# EasyEDA Pro project AmpBoard64SMD.eprj, board PCB1
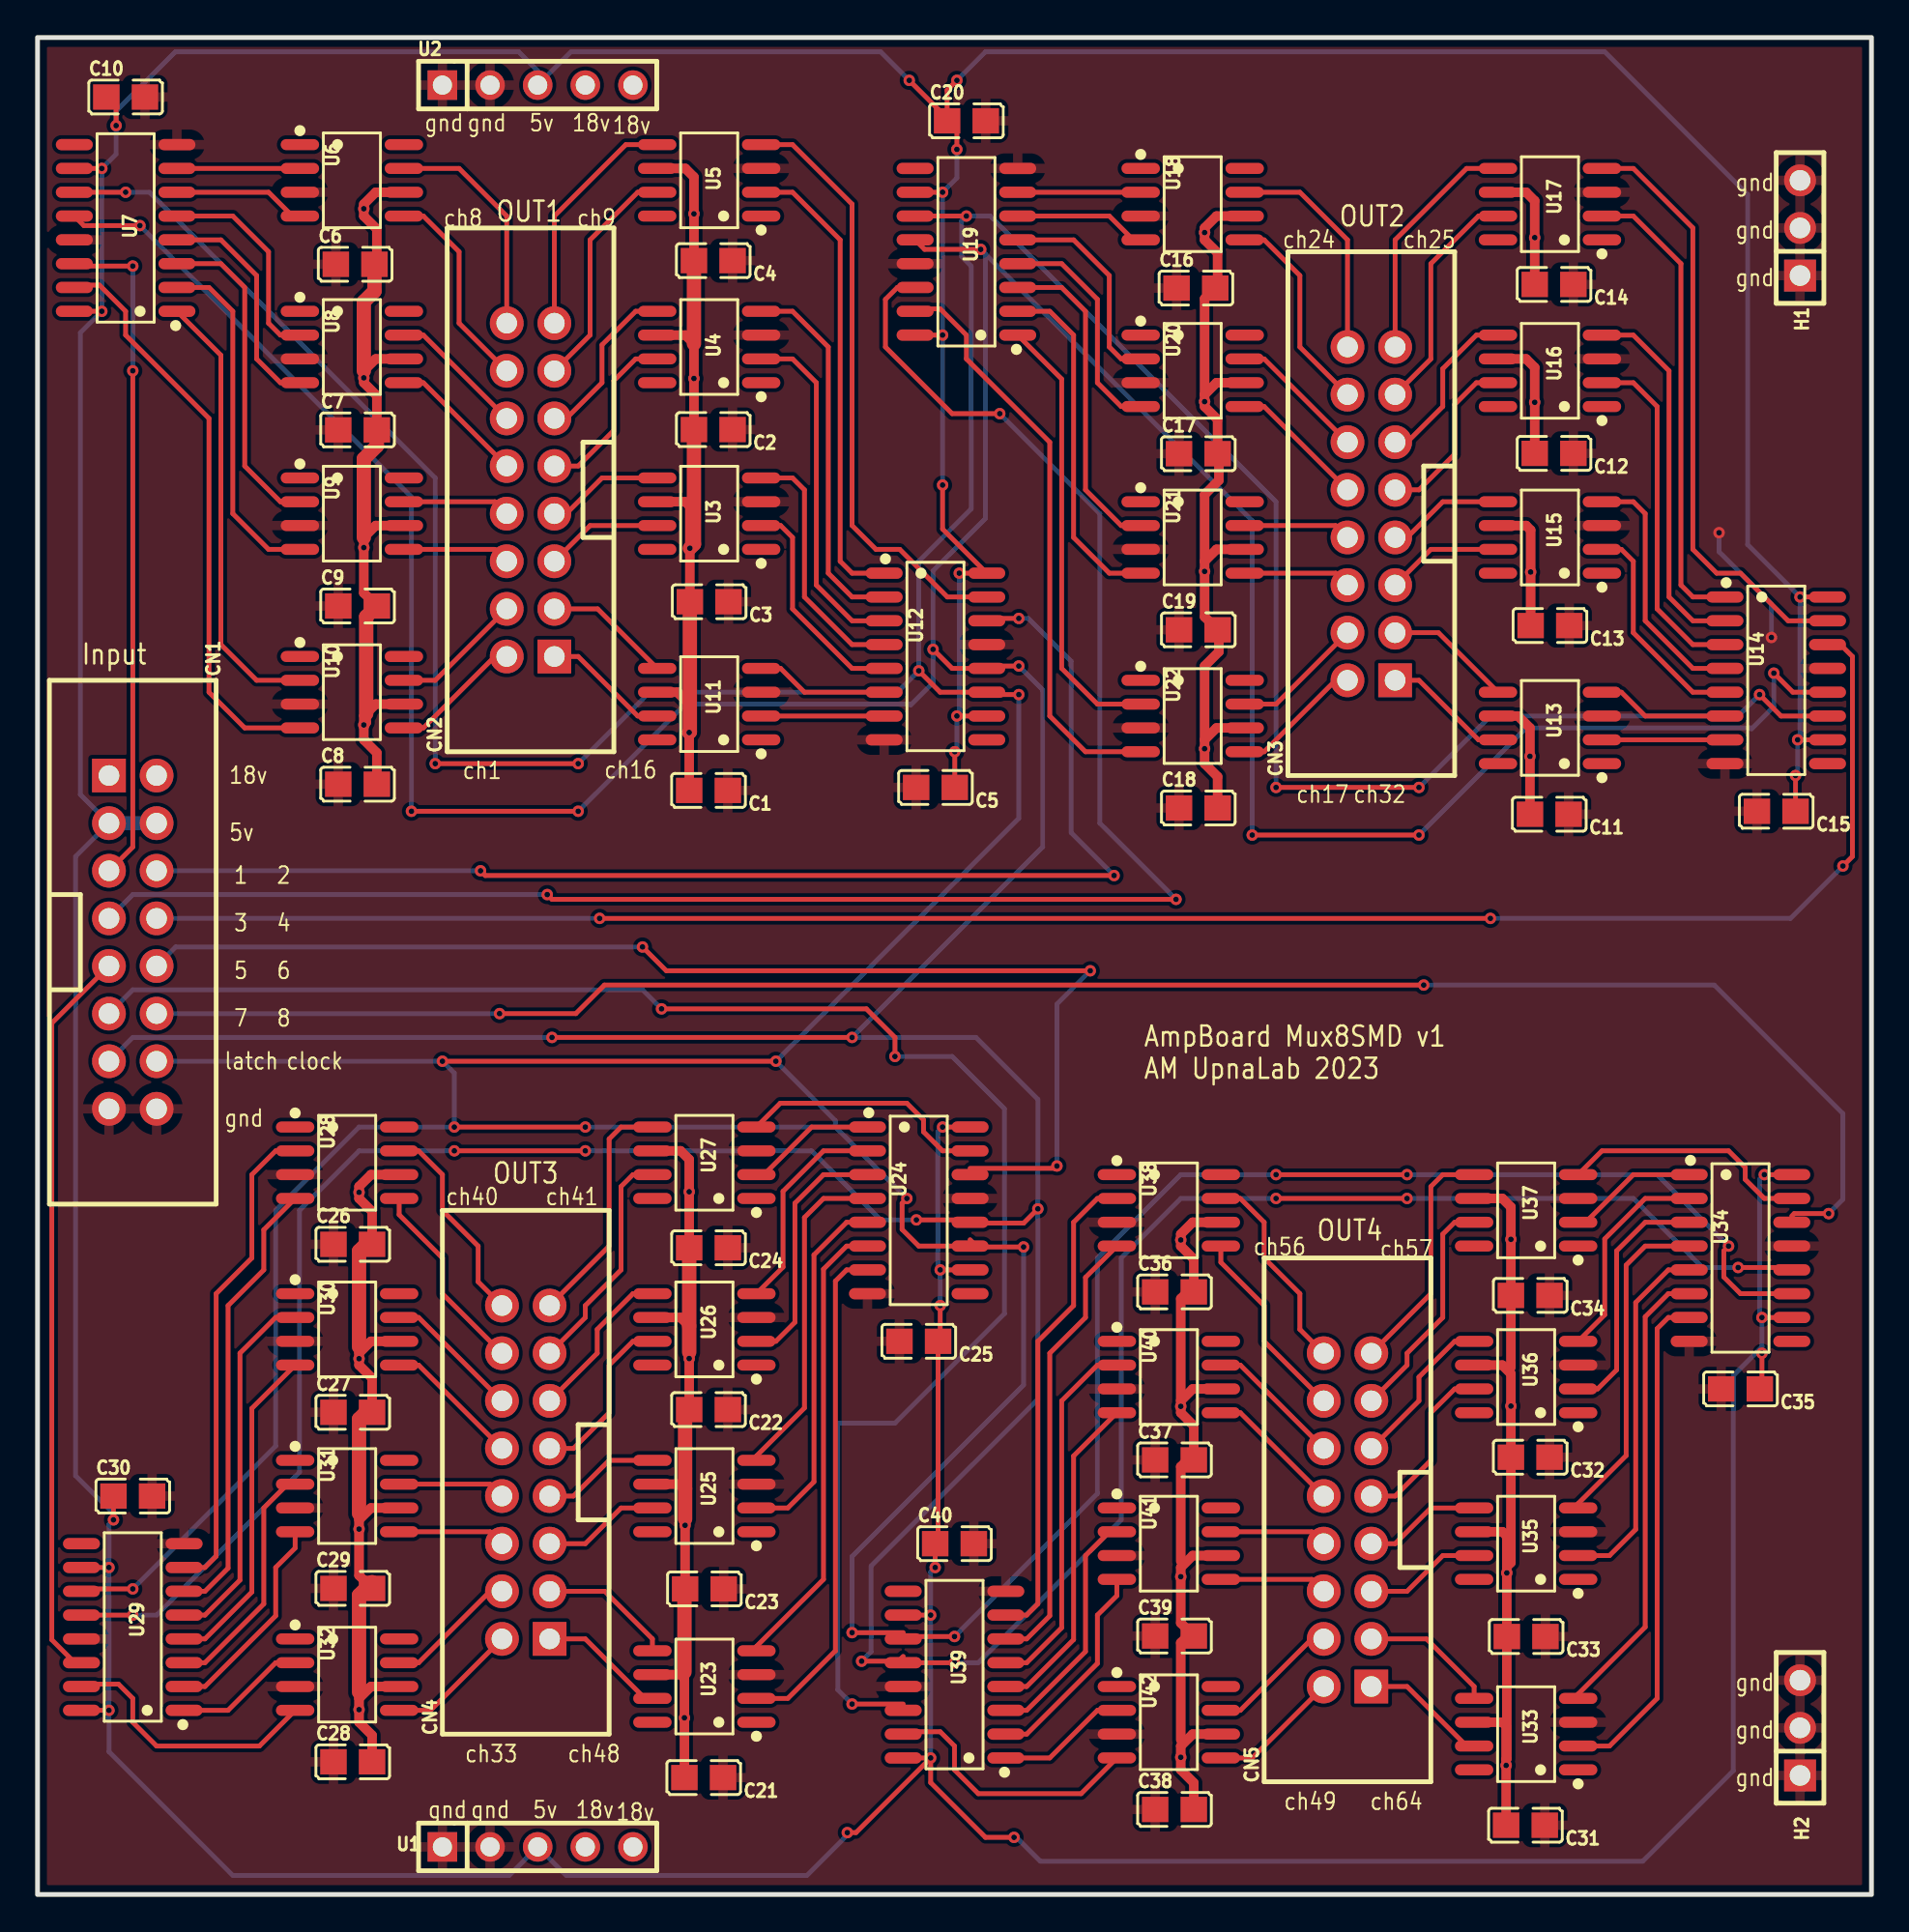
[diagram p3: board, top side]
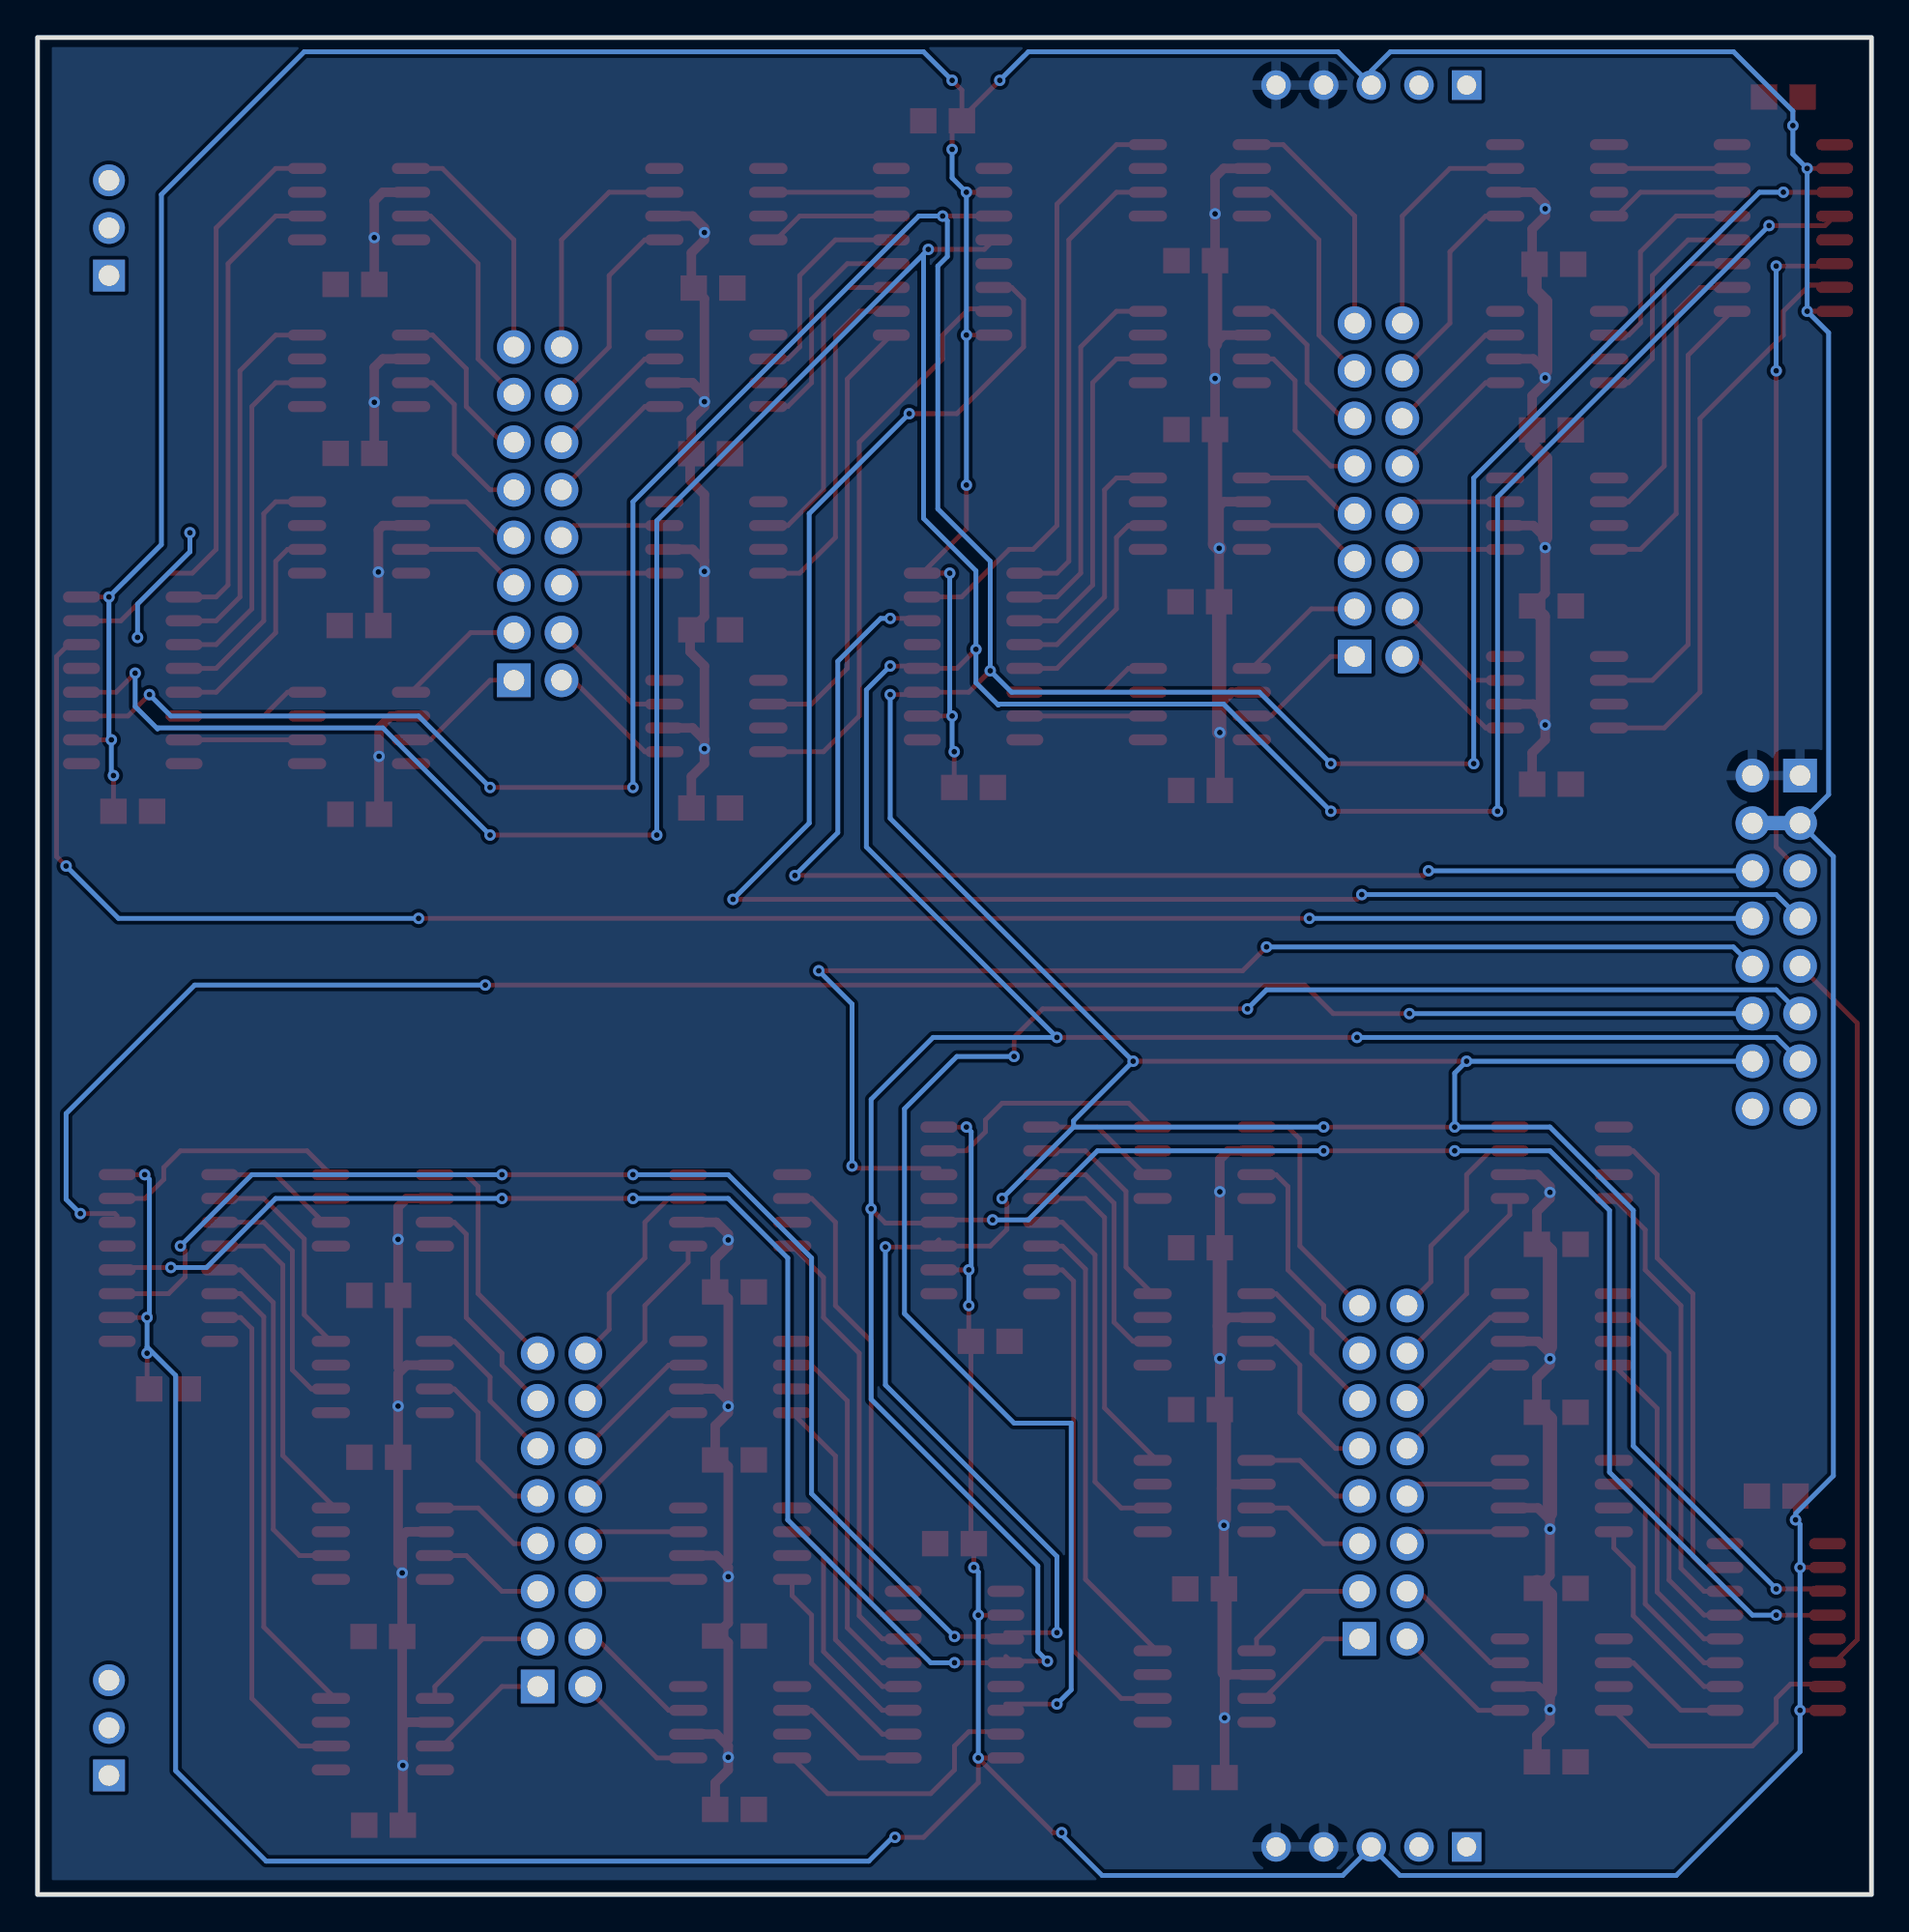
[diagram p4: board, bottom side, seen from below]

Outline 97.79 x 99.06 mm; copper layers: Top Layer, Bottom Layer. Coordinates in mm from the lower left corner of the outline.
Outline path: rectangle 0,99.06 97.79,0
Stack: Top Layer 0.035mm / Dielectric1 1.51mm FR4 er 4.5 / Bottom Layer 0.035mm

## Design rules (mm)
template: JLCPCB Capability(Two Layers Board)
spacing copperThickness1oz (default): track to track 0.102, other pairs 0.152 to 0.3
spacing copperThickness2oz: track to track 0.203, other pairs 0.152 to 0.3
track width copperThickness1oz (default): min 0.127, default 0.254, max 2.54
track width copperThickness2oz: min 0.203, default 0.254, max 2.54
differential pair differentialPair (default): width min 0.127, default 0.254, max 2.54; gap min 0.152, default 0.152
via viaSize (default): diameter min 0.5, default 0.61, max 10; hole min 0.3, default 0.305, max 6.3

## Placement (name value [footprint] x y rotation side)
C1  100pF  [C0805]  35.78 58.9 180 top
C2  100pF  [C0805]  36.03 78.14 180 top
C3  100pF  [C0805]  35.81 68.96 180 top
C4  100pF  [C0805]  36.03 87.16 180 top
C5  100pF  [C0805]  47.88 59.06 180 top
C6  100pF  [C0805]  16.94 86.96 0 top
C7  100pF  [C0805]  17.06 78.13 0 top
C8  100pF  [C0805]  17.06 59.23 0 top
C9  100pF  [C0805]  17.06 68.73 0 top
C10  100pF  [C0805]  4.7 95.89 0 top
C11  100pF  [C0805]  80.61 57.63 180 top
C12  100pF  [C0805]  80.86 76.88 180 top
C13  100pF  [C0805]  80.65 67.69 180 top
C14  100pF  [C0805]  80.86 85.89 180 top
C15  100pF  [C0805]  92.71 57.78 180 top
C16  100pF  [C0805]  61.77 85.69 0 top
C17  100pF  [C0805]  61.9 76.86 0 top
C18  100pF  [C0805]  61.9 57.96 0 top
C19  100pF  [C0805]  61.9 67.46 0 top
C20  100pF  [C0805]  49.53 94.62 0 top
C21  100pF  [C0805]  35.52 6.24 180 top
C22  100pF  [C0805]  35.78 25.87 180 top
C23  100pF  [C0805]  35.56 16.3 180 top
C24  100pF  [C0805]  35.78 34.5 180 top
C25  100pF  [C0805]  46.99 29.51 180 top
C26  100pF  [C0805]  16.81 34.68 0 top
C27  100pF  [C0805]  16.81 25.72 0 top
C28  100pF  [C0805]  16.81 7.08 0 top
C29  100pF  [C0805]  16.81 16.33 0 top
C30  100pF  [C0805]  5.08 21.25 0 top
C31  100pF  [C0805]  79.34 3.7 180 top
C32  100pF  [C0805]  79.59 23.33 180 top
C33  100pF  [C0805]  79.38 13.76 180 top
C34  100pF  [C0805]  79.59 31.96 180 top
C35  100pF  [C0805]  90.81 26.97 180 top
C36  100pF  [C0805]  60.62 32.14 0 top
C37  100pF  [C0805]  60.62 23.18 0 top
C38  100pF  [C0805]  60.62 4.54 0 top
C39  100pF  [C0805]  60.62 13.79 0 top
C40  100pF  [C0805]  48.9 18.72 0 top
CN1  KH-2.54PH180-2X8P-L8.9  [conn-th_16p-p2.54_kinghelm_kh-2.54ph180-2x8p-l8.9]  5.08 50.8 270 top
CN2  KH-2.54PH180-2X8P-L8.9  [CONN-TH_16P-P2.54_KINGHELM_KH-2.54PH180-2X8P-L8.9]  26.29 74.93 90 top
CN3  KH-2.54PH180-2X8P-L8.9  [CONN-TH_16P-P2.54_KINGHELM_KH-2.54PH180-2X8P-L8.9]  71.12 73.66 90 top
CN4  KH-2.54PH180-2X8P-L8.9  [CONN-TH_16P-P2.54_KINGHELM_KH-2.54PH180-2X8P-L8.9]  26.03 22.53 90 top
CN5  KH-2.54PH180-2X8P-L8.9  [CONN-TH_16P-P2.54_KINGHELM_KH-2.54PH180-2X8P-L8.9]  69.85 19.99 90 top
H1  KH-2.54PH180-1X3P-L11.5  [hdr-th_3p-p2.54-v-m]  93.98 88.9 90 top
H2  KH-2.54PH180-1X3P-L11.5  [hdr-th_3p-p2.54-v-m]  93.98 8.89 90 top
U1  KH-2.54FH-1X5P-H8.5  [hdr-th_5p-p2.54-v-f]  26.67 2.54 0 top
U2  KH-2.54FH-1X5P-H8.5  [hdr-th_5p-p2.54-v-f]  26.67 96.52 0 top
U3  IXDN602SIATR  [SOIC-8_L4.9-W3.9-P1.27-LS6.0-BL]  35.81 73.66 90 top
U4  IXDN602SIATR  [SOIC-8_L4.9-W3.9-P1.27-LS6.0-BL]  35.81 82.55 90 top
U5  IXDN602SIATR  [SOIC-8_L4.9-W3.9-P1.27-LS6.0-BL]  35.81 91.44 90 top
U6  IXDN602SIATR  [SOIC-8_L4.9-W3.9-P1.27-LS6.0-BL]  16.76 91.44 270 top
U7  74HC595D,118  [SOIC-16_L9.9-W3.9-P1.27-LS6.0-BL]  4.7 88.9 90 top
U8  IXDN602SIATR  [SOIC-8_L4.9-W3.9-P1.27-LS6.0-BL]  16.76 82.55 270 top
U9  IXDN602SIATR  [SOIC-8_L4.9-W3.9-P1.27-LS6.0-BL]  16.76 73.66 270 top
U10  IXDN602SIATR  [SOIC-8_L4.9-W3.9-P1.27-LS6.0-BL]  16.76 64.14 270 top
U11  IXDN602SIATR  [SOIC-8_L4.9-W3.9-P1.27-LS6.0-BL]  35.81 63.5 90 top
U12  74HC595D,118  [SOIC-16_L9.9-W3.9-P1.27-LS6.0-BL]  47.88 66.04 270 top
U13  IXDN602SIATR  [SOIC-8_L4.9-W3.9-P1.27-LS6.0-BL]  80.65 62.23 90 top
U14  74HC595D,118  [SOIC-16_L9.9-W3.9-P1.27-LS6.0-BL]  92.71 64.77 270 top
U15  IXDN602SIATR  [SOIC-8_L4.9-W3.9-P1.27-LS6.0-BL]  80.65 72.39 90 top
U16  IXDN602SIATR  [SOIC-8_L4.9-W3.9-P1.27-LS6.0-BL]  80.65 81.28 90 top
U17  IXDN602SIATR  [SOIC-8_L4.9-W3.9-P1.27-LS6.0-BL]  80.65 90.17 90 top
U18  IXDN602SIATR  [SOIC-8_L4.9-W3.9-P1.27-LS6.0-BL]  61.59 90.17 270 top
U19  74HC595D,118  [SOIC-16_L9.9-W3.9-P1.27-LS6.0-BL]  49.53 87.63 90 top
U20  IXDN602SIATR  [SOIC-8_L4.9-W3.9-P1.27-LS6.0-BL]  61.59 81.28 270 top
U21  IXDN602SIATR  [SOIC-8_L4.9-W3.9-P1.27-LS6.0-BL]  61.59 72.39 270 top
U22  IXDN602SIATR  [SOIC-8_L4.9-W3.9-P1.27-LS6.0-BL]  61.59 62.87 270 top
U23  IXDN602SIATR  [SOIC-8_L4.9-W3.9-P1.27-LS6.0-BL]  35.56 11.09 90 top
U24  74HC595D,118  [SOIC-16_L9.9-W3.9-P1.27-LS6.0-BL]  46.99 36.5 270 top
U25  IXDN602SIATR  [SOIC-8_L4.9-W3.9-P1.27-LS6.0-BL]  35.56 21.25 90 top
U26  IXDN602SIATR  [SOIC-8_L4.9-W3.9-P1.27-LS6.0-BL]  35.56 30.15 90 top
U27  IXDN602SIATR  [SOIC-8_L4.9-W3.9-P1.27-LS6.0-BL]  35.56 39.03 90 top
U28  IXDN602SIATR  [SOIC-8_L4.9-W3.9-P1.27-LS6.0-BL]  16.51 39.03 270 top
U29  74HC595D,118  [SOIC-16_L9.9-W3.9-P1.27-LS6.0-BL]  5.08 14.27 90 top
U30  IXDN602SIATR  [SOIC-8_L4.9-W3.9-P1.27-LS6.0-BL]  16.51 30.15 270 top
U31  IXDN602SIATR  [SOIC-8_L4.9-W3.9-P1.27-LS6.0-BL]  16.51 21.25 270 top
U32  IXDN602SIATR  [SOIC-8_L4.9-W3.9-P1.27-LS6.0-BL]  16.51 11.73 270 top
U33  IXDN602SIATR  [SOIC-8_L4.9-W3.9-P1.27-LS6.0-BL]  79.38 8.56 90 top
U34  74HC595D,118  [SOIC-16_L9.9-W3.9-P1.27-LS6.0-BL]  90.81 33.95 270 top
U35  IXDN602SIATR  [SOIC-8_L4.9-W3.9-P1.27-LS6.0-BL]  79.38 18.72 90 top
U36  IXDN602SIATR  [SOIC-8_L4.9-W3.9-P1.27-LS6.0-BL]  79.38 27.6 90 top
U37  IXDN602SIATR  [SOIC-8_L4.9-W3.9-P1.27-LS6.0-BL]  79.38 36.5 90 top
U38  IXDN602SIATR  [SOIC-8_L4.9-W3.9-P1.27-LS6.0-BL]  60.32 36.5 270 top
U39  74HC595D,118  [SOIC-16_L9.9-W3.9-P1.27-LS6.0-BL]  48.9 11.73 90 top
U40  IXDN602SIATR  [SOIC-8_L4.9-W3.9-P1.27-LS6.0-BL]  60.32 27.6 270 top
U41  IXDN602SIATR  [SOIC-8_L4.9-W3.9-P1.27-LS6.0-BL]  60.32 18.72 270 top
U42  IXDN602SIATR  [SOIC-8_L4.9-W3.9-P1.27-LS6.0-BL]  60.32 9.19 270 top

## Footprints (pads in the part's own frame, mm; a bottom-side part is the same pattern mirrored in y, then rotated)
C0805
  rect 1.41x1.35 smd: 1(-1.03,0) 2(1.03,0)
conn-th_16p-p2.54_kinghelm_kh-2.54ph180-2x8p-l8.9
  rect 1.8x1.8 hole 1.1: 1(-8.89,-1.27)
  round 1.8 hole 1.1: 2(-8.89,1.27) 3(-6.35,-1.27) 4(-6.35,1.27) 5(-3.81,-1.27) 6(-3.81,1.27) 7(-1.27,-1.27) 8(-1.27,1.27) 9(1.27,-1.27) 10(1.27,1.27) 11(3.81,-1.27) 12(3.81,1.27) 13(6.35,-1.27) 14(6.35,1.27) 15(8.89,-1.27) 16(8.89,1.27)
CONN-TH_16P-P2.54_KINGHELM_KH-2.54PH180-2X8P-L8.9
  rect 1.8x1.8 hole 1.1: 1(-8.89,-1.27)
  round 1.8 hole 1.1: 2(-8.89,1.27) 3(-6.35,-1.27) 4(-6.35,1.27) 5(-3.81,-1.27) 6(-3.81,1.27) 7(-1.27,-1.27) 8(-1.27,1.27) 9(1.27,-1.27) 10(1.27,1.27) 11(3.81,-1.27) 12(3.81,1.27) 13(6.35,-1.27) 14(6.35,1.27) 15(8.89,-1.27) 16(8.89,1.27)
hdr-th_3p-p2.54-v-m
  rect 1.7x1.7 hole 1.1: 1(-2.54,0)
  round 1.7 hole 1.1: 2(0,0) 3(2.54,0)
hdr-th_5p-p2.54-v-f
  rect 1.575x1.575 hole 1.02: 1(-5.08,0)
  round 1.575 hole 1.02: 2(-2.54,0) 3(0,0) 4(2.54,0) 5(5.08,0)
SOIC-8_L4.9-W3.9-P1.27-LS6.0-BL
  oval 0.588x2.045 smd: 1(-1.905,-2.772) 2(-0.635,-2.772) 3(0.635,-2.772) 4(1.905,-2.772) 5(1.905,2.772) 6(0.635,2.772) 7(-0.635,2.772) 8(-1.905,2.772)
SOIC-16_L9.9-W3.9-P1.27-LS6.0-BL
  oval 0.602x1.971 smd: 1(-4.445,-2.736) 2(-3.175,-2.736) 3(-1.905,-2.736) 4(-0.635,-2.736) 5(0.635,-2.736) 6(1.905,-2.736) 7(3.175,-2.736) 8(4.445,-2.736) 9(4.445,2.736) 10(3.175,2.736) 11(1.905,2.736) 12(0.635,2.736) 13(-0.635,2.736) 14(-1.905,2.736) 15(-3.175,2.736) 16(-4.445,2.736)

## Nets
+5V: C5.1 C10.1 C15.1 C20.1 C25.1 C30.1 C35.1 C40.1 CN1.3 CN1.4 U1.3 U2.3 U7.10 U7.16 U12.10 U12.16 U14.10 U14.16 U19.10 U19.16 U24.10 U24.16 U29.10 U29.16 U34.10 U34.16 U39.10 U39.16
GND: C1.1 C2.1 C3.1 C4.1 C5.2 C6.1 C7.1 C8.1 C9.1 C10.2 C11.1 C12.1 C13.1 C14.1 C15.2 C16.1 C17.1 C18.1 C19.1 C20.2 C21.1 C22.1 C23.1 C24.1 C25.2 C26.1 C27.1 C28.1 C29.1 C30.2 C31.1 C32.1 C33.1 C34.1 C35.2 C36.1 C37.1 C38.1 C39.1 C40.2 CN1.15 CN1.16 H1.1 H1.2 H1.3 H2.1 H2.2 H2.3 U1.1 U1.2 U2.1 U2.2 U3.3 U4.3 U5.3 U6.3 U7.8 U7.13 U8.3 U9.3 U10.3 U11.3 U12.8 U12.13 U13.3 U14.8 U14.13 U15.3 U16.3 U17.3 U18.3 U19.8 U19.13 U20.3 U21.3 U22.3 U23.3 U24.8 U24.13 U25.3 U26.3 U27.3 U28.3 U29.8 U29.13 U30.3 U31.3 U32.3 U33.3 U34.8 U34.13 U35.3 U36.3 U37.3 U38.3 U39.8 U39.13 U40.3 U41.3 U42.3
VCC: C1.2 C2.2 C3.2 C4.2 C6.2 C7.2 C8.2 C9.2 C11.2 C12.2 C13.2 C14.2 C16.2 C17.2 C18.2 C19.2 C21.2 C22.2 C23.2 C24.2 C26.2 C27.2 C28.2 C29.2 C31.2 C32.2 C33.2 C34.2 C36.2 C37.2 C38.2 C39.2 CN1.1 CN1.2 U1.4 U1.5 U2.4 U2.5 U3.6 U4.6 U5.6 U6.6 U8.6 U9.6 U10.6 U11.6 U13.6 U15.6 U16.6 U17.6 U18.6 U20.6 U21.6 U22.6 U23.6 U25.6 U26.6 U27.6 U28.6 U30.6 U31.6 U32.6 U33.6 U35.6 U36.6 U37.6 U38.6 U40.6 U41.6 U42.6
CLOCK: CN1.14 U7.11 U12.11 U14.11 U19.11 U24.11 U29.11 U34.11 U39.11
LATCH: CN1.13 U7.12 U12.12 U14.12 U19.12 U24.12 U29.12 U34.12 U39.12
MUX1: CN1.5 U7.14
MUX2: CN1.6 U12.14
MUX3: CN1.7 U19.14
MUX4: CN1.8 U14.14
MUX5: CN1.9 U29.14
MUX6: CN1.10 U24.14
MUX7: CN1.11 U39.14
MUX8: CN1.12 U34.14
$1I756/$1N942: CN2.1 U11.7
$1I756/$1N946: CN2.3 U11.5
$1I756/$1N951: CN2.5 U3.7
$1I756/$1N956: CN2.7 U3.5
$1I756/$1N961: CN2.9 U4.7
$1I756/$1N970: CN2.11 U4.5
$1I756/$1N975: CN2.13 U5.7
$1I756/$1N980: CN2.15 U5.5
$1I756/$1N1841: CN2.16 U6.7
$1I756/$1N1844: CN2.14 U6.5
$1I756/$1N1848: CN2.12 U8.7
$1I756/$1N1852: CN2.10 U8.5
$1I756/$1N1856: CN2.8 U9.7
$1I756/$1N1860: CN2.6 U9.5
$1I756/$1N1864: CN2.4 U10.7
$1I756/$1N1868: CN2.2 U10.5
$1I756/$1N3344: U5.4 U12.15
$1I756/$1N3349: U5.2 U12.1
$1I756/$1N3353: U4.4 U12.2
$1I756/$1N3358: U4.2 U12.3
$1I756/$1N3363: U3.4 U12.4
$1I756/$1N3368: U3.2 U12.5
$1I756/$1N3373: U11.4 U12.6
$1I756/$1N3378: U11.2 U12.7
$1I756/$1N3403: U7.15 U10.4
$1I756/$1N3408: U7.1 U10.2
$1I756/$1N3412: U7.2 U9.4
$1I756/$1N3424: U7.3 U9.2
$1I756/$1N3429: U7.4 U8.4
$1I756/$1N3434: U7.5 U8.2
$1I756/$1N3439: U6.4 U7.6
$1I756/$1N3444: U6.2 U7.7
$1I774/$1N942: CN3.1 U13.7
$1I774/$1N946: CN3.3 U13.5
$1I774/$1N951: CN3.5 U15.7
$1I774/$1N956: CN3.7 U15.5
$1I774/$1N961: CN3.9 U16.7
$1I774/$1N970: CN3.11 U16.5
$1I774/$1N975: CN3.13 U17.7
$1I774/$1N980: CN3.15 U17.5
$1I774/$1N1841: CN3.16 U18.7
$1I774/$1N1844: CN3.14 U18.5
$1I774/$1N1848: CN3.12 U20.7
$1I774/$1N1852: CN3.10 U20.5
$1I774/$1N1856: CN3.8 U21.7
$1I774/$1N1860: CN3.6 U21.5
$1I774/$1N1864: CN3.4 U22.7
$1I774/$1N1868: CN3.2 U22.5
$1I774/$1N3344: U14.15 U17.4
$1I774/$1N3349: U14.1 U17.2
$1I774/$1N3353: U14.2 U16.4
$1I774/$1N3358: U14.3 U16.2
$1I774/$1N3363: U14.4 U15.4
$1I774/$1N3368: U14.5 U15.2
$1I774/$1N3373: U13.4 U14.6
$1I774/$1N3378: U13.2 U14.7
$1I774/$1N3403: U19.15 U22.4
$1I774/$1N3408: U19.1 U22.2
$1I774/$1N3412: U19.2 U21.4
$1I774/$1N3424: U19.3 U21.2
$1I774/$1N3429: U19.4 U20.4
$1I774/$1N3434: U19.5 U20.2
$1I774/$1N3439: U18.4 U19.6
$1I774/$1N3444: U18.2 U19.7
$1I810/$1N942: CN4.1 U23.7
$1I810/$1N946: CN4.3 U23.5
$1I810/$1N951: CN4.5 U25.7
$1I810/$1N956: CN4.7 U25.5
$1I810/$1N961: CN4.9 U26.7
$1I810/$1N970: CN4.11 U26.5
$1I810/$1N975: CN4.13 U27.7
$1I810/$1N980: CN4.15 U27.5
$1I810/$1N1841: CN4.16 U28.7
$1I810/$1N1844: CN4.14 U28.5
$1I810/$1N1848: CN4.12 U30.7
$1I810/$1N1852: CN4.10 U30.5
$1I810/$1N1856: CN4.8 U31.7
$1I810/$1N1860: CN4.6 U31.5
$1I810/$1N1864: CN4.4 U32.7
$1I810/$1N1868: CN4.2 U32.5
$1I810/$1N2749: U24.15 U27.4
$1I810/$1N2754: U24.1 U27.2
$1I810/$1N2758: U24.2 U26.4
$1I810/$1N2763: U24.3 U26.2
$1I810/$1N2768: U24.4 U25.4
$1I810/$1N2773: U24.5 U25.2
$1I810/$1N2778: U23.4 U24.6
$1I810/$1N2783: U23.2 U24.7
$1I810/$1N2803: U29.15 U32.4
$1I810/$1N2813: U29.1 U32.2
$1I810/$1N2823: U29.2 U31.4
$1I810/$1N2835: U29.3 U31.2
$1I810/$1N2845: U29.4 U30.4
$1I810/$1N2857: U29.5 U30.2
$1I810/$1N2869: U28.4 U29.6
$1I810/$1N2881: U28.2 U29.7
$1I828/$1N942: CN5.1 U33.7
$1I828/$1N946: CN5.3 U33.5
$1I828/$1N951: CN5.5 U35.7
$1I828/$1N956: CN5.7 U35.5
$1I828/$1N961: CN5.9 U36.7
$1I828/$1N970: CN5.11 U36.5
$1I828/$1N975: CN5.13 U37.7
$1I828/$1N980: CN5.15 U37.5
$1I828/$1N1841: CN5.16 U38.7
$1I828/$1N1844: CN5.14 U38.5
$1I828/$1N1848: CN5.12 U40.7
$1I828/$1N1852: CN5.10 U40.5
$1I828/$1N1856: CN5.8 U41.7
$1I828/$1N1860: CN5.6 U41.5
$1I828/$1N1864: CN5.4 U42.7
$1I828/$1N1868: CN5.2 U42.5
$1I828/$1N2749: U34.15 U37.4
$1I828/$1N2754: U34.1 U37.2
$1I828/$1N2758: U34.2 U36.4
$1I828/$1N2763: U34.3 U36.2
$1I828/$1N2768: U34.4 U35.4
$1I828/$1N2773: U34.5 U35.2
$1I828/$1N2778: U33.4 U34.6
$1I828/$1N2783: U33.2 U34.7
$1I828/$1N2803: U39.15 U42.4
$1I828/$1N2813: U39.1 U42.2
$1I828/$1N2823: U39.2 U41.4
$1I828/$1N2835: U39.3 U41.2
$1I828/$1N2845: U39.4 U40.4
$1I828/$1N2857: U39.5 U40.2
$1I828/$1N2869: U38.4 U39.6
$1I828/$1N2881: U38.2 U39.7

Pads without a net: U3 1 8; U4 1 8; U5 1 8; U6 1 8; U7 9; U8 1 8; U9 1 8; U10 1 8; U11 1 8; U12 9; U13 1 8; U14 9; U15 1 8; U16 1 8; U17 1 8; U18 1 8; U19 9; U20 1 8; U21 1 8; U22 1 8; U23 1 8; U24 9; U25 1 8; U26 1 8; U27 1 8; U28 1 8; U29 9; U30 1 8; U31 1 8; U32 1 8; U33 1 8; U34 9; U35 1 8; U36 1 8; U37 1 8; U38 1 8; U39 9; U40 1 8; U41 1 8; U42 1 8

## Via types
v1: diameter 0.61, hole 0.305, Top Layer to Bottom Layer, 125 vias

## Routing (per net, layer and track width the routed paths; a pad name or vN(x,y) marks a point on that pad's centre or on a via; arc(x,y) is an arc through that point)
+5V: length 455.7
  Top Layer w0.254: C5.1 v1(48.91,60.96) ; C35.1 91.95,27.08 v1(91.95,28.88) ; v1(49.02,96.77) 48.5,96.25 48.5,94.76 ; v1(48.26,40.94) U24.16 ; C25.1 48.02,19.21 47.87,19.05 ; C25.1 48.02,29.84 ; C25.1 48.13,29.62 v1(48.13,31.42) ; v1(47.62,7.28) 43.64,3.3 v1(43.18,3.3) ; v1(47.62,7.28) U39.16 ; v1(47.62,7.28) 47.62,5.97 50.55,3.05 v1(52.07,3.05) ; v1(3.81,17.44) 2.34,17.44 ; v1(3.81,9.82) 2.34,9.82 ; v1(48.26,83.19) U19.16 ; v1(93.85,61.59) U14.10 ; C15.1 v1(93.74,59.69) ; C30.1 v1(4.05,19.99) ; C40.1 v1(47.87,17.44) ; v1(48.13,33.32) U24.10 ; v1(48.26,75.18) 48.26,72.84 50.61,70.48 v1(49.15,70.48) ; v1(48.26,90.81) U19.10 ; 48.5,94.76 C20.1 49.02,94.09 v1(49.02,93.09) ; 48.5,94.76 v1(46.48,96.77) ; v1(93.98,69.22) U14.16 ; v1(4.19,94.36) 4.19,95.36 C10.1 ; v1(3.43,92.08) U7.10 ; v1(47.62,14.91) U39.10 ; v1(91.95,30.78) U34.10 ; v1(92.07,38.4) U34.16 ; v1(3.43,84.45) U7.16 ; v1(49.02,62.87) U12.10
  Bottom Layer w0.254: v1(48.13,31.42) v1(48.13,33.32) 48.01,33.45 48.01,40.69 v1(48.26,40.94) ; v1(47.62,7.28) v1(47.62,14.91) 47.62,17.21 v1(47.87,17.44) ; 91.95,29.21 v1(91.95,30.78) 91.82,30.91 91.82,38.15 v1(92.07,38.4) ; 91.95,29.21 v1(91.95,28.88) ; 91.95,29.21 90.42,27.69 90.42,6.6 85.6,1.78 53.47,1.78 52.2,3.05 v1(52.07,3.05) ; v1(93.74,59.69) 93.85,59.8 v1(93.85,61.59) 93.98,61.72 v1(93.98,69.22) 91.19,72.01 91.19,90.68 83.57,98.3 50.55,98.3 v1(49.02,96.77) ; 4.05,20.32 2.03,22.34 2.03,55.37 CN1.3 2.29,58.67 2.29,83.31 v1(3.43,84.45) v1(3.43,92.08) 4.19,92.84 v1(4.19,94.36) 4.19,95.14 7.35,98.3 25.65,98.3 26.67,97.28 U2.3 28.45,98.3 44.96,98.3 v1(46.48,96.77) ; v1(48.26,75.18) v1(48.26,83.19) v1(48.26,90.81) 49.02,91.57 v1(49.02,93.09) ; v1(49.15,70.48) 49.15,62.99 v1(49.02,62.87) 49.02,61.07 v1(48.91,60.96) ; v1(43.18,3.3) 43.18,3.18 41.02,1.02 28.19,1.02 U1.3 25.15,1.02 10.41,1.02 3.81,7.62 v1(3.81,9.82) v1(3.81,17.44) 3.81,19.75 v1(4.05,19.99)
  Bottom Layer w0.762: CN1.3 CN1.4
GND: length 6.7
  Bottom Layer w0.254: v1(89.66,72.64) 89.66,71.63 92.46,68.83 v1(92.46,67.06)
VCC: length 328.5
  Top Layer w0.508: U30.6 17.78,29.51 17.14,28.88 17.14,28.24 17.84,27.55 C27.2 ; 62.23,61.59 v1(62.23,61.12) 62.23,60.33 62.93,59.63 C18.2 ; 62.23,61.59 62.87,62.23 U22.6 ; 62.23,61.59 62.23,65.53 62.99,66.29 62.99,67.4 C19.2 62.23,68.16 v1(62.23,70.58) 62.23,71.12 ; 78.56,28.12 C34.2 v1(78.56,34.95) 78.56,36.67 78.1,37.13 U37.6 ; 62.23,80.01 62.87,80.64 U20.6 ; 62.23,80.01 62.23,85.12 C16.2 62.93,85.82 62.93,87.57 62.23,88.27 62.23,88.9 62.87,89.53 U18.6 ; 62.23,80.01 v1(62.23,79.63) 62.23,79.38 62.93,78.68 C17.2 62.99,76.79 62.99,75.44 62.23,74.68 62.23,71.12 ; U23.6 34.29,11.73 34.49,11.53 v1(34.49,9.43) C21.2 ; 78.31,7.22 78.34,7.26 C33.2 v1(78.34,17.15) 78.34,17.49 ; 78.31,7.22 v1(78.31,6.89) C31.2 ; 78.31,7.22 78.31,8.99 78.1,9.19 U33.6 ; C4.2 v1(35,89.65) 35,91.62 34.54,92.08 U5.6 ; 34.53,20.03 v1(34.53,19.69) C23.2 ; 78.34,17.49 78.34,19.11 78.1,19.35 U35.6 ; 78.34,17.49 78.56,17.71 C32.2 v1(78.56,26.05) 78.56,27.78 78.1,28.24 U36.6 ; 61.49,13.96 61.66,14.12 ; 61.49,13.96 C39.2 ; 61.49,13.96 60.96,14.48 v1(60.96,16.95) 60.96,17.44 61.59,18.08 U41.6 ; 61.49,13.96 60.96,13.43 60.96,8.25 ; C13.2 v1(79.62,70.55) 79.62,72.78 79.38,73.03 U15.6 ; U16.6 79.38,81.92 79.83,81.46 v1(79.83,79.6) C12.2 ; C29.2 17.67,16.5 17.14,17.02 v1(17.14,19.49) 17.14,19.99 ; C8.2 18.09,60.9 17.4,61.59 v1(17.4,62.39) ; 34.75,34.83 v1(34.75,37.49) 34.75,39.21 34.29,39.67 U27.6 ; U40.6 61.59,26.97 60.96,26.34 60.96,25.7 61.66,25 61.66,23.52 ; v1(17.4,62.39) 17.4,62.87 17.53,62.99 ; v1(17.4,62.39) 17.53,62.52 17.53,62.99 ; C7.2 18.09,79.95 17.4,80.64 17.4,81.28 18.03,81.92 19.54,81.92 ; 17.53,62.99 18.03,63.5 U10.6 ; C28.2 17.84,8.5 17.14,9.19 v1(17.14,9.86) 17.14,10.46 ; U38.6 61.59,35.86 60.96,35.23 v1(60.96,34.92) 60.96,34.59 61.66,33.89 61.66,32.48 ; 17.14,19.99 17.14,20.32 ; 17.14,19.99 17.78,20.62 U31.6 ; C6.2 18.09,87.09 18.09,88.84 17.4,89.53 17.4,90.17 18.03,90.81 U6.6 ; C2.2 v1(35,80.87) 35,82.73 34.54,83.19 U4.6 ; 61.66,32.48 60.96,31.78 60.96,26.38 ; 61.66,32.48 C36.2 ; 60.96,17.78 60.96,22.82 61.66,23.52 ; C38.2 61.66,5.96 60.96,6.65 v1(60.96,7.32) 60.96,7.92 61.59,8.56 U42.6 ; U21.6 62.87,71.75 62.23,71.12 ; 17.14,10.46 17.78,11.09 U32.6 ; 17.14,10.46 17.14,10.8 ; 34.75,28.93 v1(34.75,28.59) C22.2 ; U17.6 79.38,90.81 79.83,90.35 v1(79.83,88.38) C14.2 ; 61.66,23.52 C37.2 ; U11.6 34.11,64.14 34.75,63.5 v1(34.75,61.98) C1.2 ; 34.75,30.32 34.29,30.78 U26.6 ; U9.6 18.03,73.03 17.4,72.39 v1(17.4,71.85) 17.4,69.43 C9.2 ; U25.6 34.29,21.89 34.53,21.65 ; 17.14,28.92 17.14,29.21 ; C11.2 v1(79.58,60.71) 79.58,62.23 78.94,62.87 U13.6 ; U28.6 17.78,38.4 17.14,37.77 v1(17.14,37.46) 17.14,37.13 17.84,36.44 C26.2 ; U3.6 34.54,74.3 34.78,74.06 v1(34.78,71.82) C3.2
  Top Layer w0.762: C7.2 18.09,77.28 17.4,76.58 17.4,72.39 ; C2.2 35,72.03 v1(34.78,71.82) ; C6.2 17.97,85.53 17.4,84.96 17.4,81.28 ; C9.2 17.53,68.17 17.53,62.99 ; C4.2 35,82.73 ; 17.14,10.8 17.14,15.97 17.67,16.5 17.84,16.66 ; 34.75,28.93 C24.2 34.75,34.83 ; 34.53,16.64 34.49,16.6 34.49,11.86 ; 34.53,20.03 34.53,25.98 34.75,26.2 ; 17.84,26.06 17.14,25.36 17.14,20.32 ; v1(34.75,61.98) 34.78,62.02 C3.2 ; 17.84,35.02 17.14,34.32 17.14,29.21
  vias: v1(17.14,28.58) v1(17.4,89.92) v1(17.4,80.9) v1(60.96,26.04) v1(62.23,88.66)
CLOCK: length 407.8
  Top Layer w0.254: v1(52.58,34.54) 50.11,34.54 49.73,34.92 ; U34.11 90.81,32.05 89.92,32.94 89.92,34.34 v1(90.17,34.59) ; v1(91.82,64.01) 92.96,62.87 U14.11 ; U7.11 v1(4.7,90.81) ; U19.11 v1(49.53,89.53) ; v1(46.99,65.28) 48.13,64.14 50.36,64.14 ; v1(29.21,40.94) v1(22.22,40.94) ; v1(48.9,13.76) 46.29,13.76 U39.11 ; v1(73.03,38.4) v1(66.04,38.4) ; U24.11 46.99,34.59 46.1,35.48 46.1,36.88 v1(46.35,37.13) ; U29.11 2.47,16.3 v1(5.08,16.3) ; v1(43.43,13.97) 46.16,13.97 ; 50.36,64.14 U12.11 ; 50.36,64.14 50.49,64.01 v1(52.32,64.01) ; v1(21.59,44.45) v1(39.37,44.45) ; v1(21.21,60.33) v1(28.83,60.33) ; v1(66.04,59.06) v1(73.66,59.06)
  Bottom Layer w0.254: v1(52.58,34.54) 52.58,27.18 43.43,18.03 v1(43.43,13.97) ; v1(5.08,16.3) 12.7,23.92 12.7,36.5 17.14,40.94 v1(22.22,40.94) 22.22,43.81 v1(21.59,44.45) CN1.14 ; v1(21.21,60.33) 21.21,75.56 5.97,90.81 v1(4.7,90.81) ; 42.54,40.94 42.54,41.28 v1(39.37,44.45) 52.32,57.4 v1(52.32,64.01) ; 42.54,40.94 v1(46.35,37.13) ; 42.54,40.94 v1(29.21,40.94) ; v1(90.17,34.59) 86.36,38.4 v1(73.03,38.4) ; v1(48.9,13.76) 56.51,21.38 56.51,33.95 60.96,38.4 v1(66.04,38.4) ; v1(66.04,59.06) 66.04,74.3 50.8,89.53 v1(49.53,89.53) 49.28,89.28 49.28,87.38 49.78,86.87 49.78,73.91 46.99,71.12 v1(46.99,65.28) 45.85,64.14 32.64,64.14 v1(28.83,60.33) ; v1(73.66,59.06) 77.47,62.87 90.68,62.87 v1(91.82,64.01)
LATCH: length 428.9
  Top Layer w0.254: v1(5.46,89.03) 2.47,89.03 U7.12 ; 50.36,65.41 48.77,65.41 v1(47.75,66.42) ; 50.36,65.41 U12.12 ; 50.36,65.41 50.49,65.53 v1(52.32,65.53) ; v1(43.94,12.45) 45.91,12.45 46.16,12.7 ; 95.45,64.14 93.6,64.14 v1(92.58,65.15) ; v1(27.43,45.72) v1(43.43,45.72) ; U24.12 49.6,35.99 v1(46.86,35.99) ; v1(19.94,57.78) v1(28.83,57.78) ; U34.12 93.41,33.45 v1(90.68,33.45) ; U19.12 47.3,87.76 v1(50.29,87.76) ; v1(5.08,14.91) U29.12 ; v1(48.9,12.37) U39.12 ; v1(22.22,39.67) v1(29.21,39.67) ; v1(53.34,36.58) 52.58,35.81 49.34,35.81 ; v1(64.77,56.52) v1(73.66,56.52) ; v1(66.04,37.13) v1(73.03,37.13)
  Bottom Layer w0.254: CN1.13 5.08,45.72 v1(27.43,45.72) ; v1(50.29,87.76) 50.55,87.5 ; 50.55,87.5 50.55,73.41 47.75,70.61 v1(47.75,66.42) 47.75,64.64 46.56,63.45 46.51,63.5 34.54,63.5 v1(28.83,57.78) ; 50.55,87.5 64.77,73.28 v1(64.77,56.52) ; v1(66.04,37.13) 60.96,37.13 57.78,33.95 57.78,19.99 50.16,12.37 v1(48.9,12.37) ; v1(22.22,39.67) 17.14,39.67 13.97,36.5 13.97,22.53 6.35,14.91 v1(5.08,14.91) ; v1(46.86,35.99) 44.96,35.99 41.28,39.67 v1(29.21,39.67) ; v1(19.94,57.78) 19.94,74.55 v1(5.46,89.03) ; v1(90.68,33.45) 88.77,33.45 85.09,37.13 v1(73.03,37.13) ; v1(73.66,56.52) 79.38,62.23 91.34,62.23 91.39,62.18 92.58,63.37 v1(92.58,65.15) ; v1(43.94,12.45) 44.45,12.95 44.45,17.53 53.34,26.42 v1(53.34,36.58) 53.34,42.42 50.04,45.72 v1(43.43,45.72) 53.59,55.88 53.59,64.26 v1(52.32,65.53)
MUX1: length 36
  Top Layer w0.254: v1(5.08,81.28) 5.08,55.88 CN1.5 ; U7.14 2.09,86.87 v1(5.08,86.87)
  Bottom Layer w0.254: v1(5.08,81.28) v1(5.08,86.87)
MUX2: length 69
  Top Layer w0.254: v1(52.32,68.07) 50.74,68.07 U12.14 ; v1(57.4,54.36) 23.88,54.36 v1(23.62,54.61)
  Bottom Layer w0.254: v1(52.32,68.07) 52.83,68.07 55.12,65.79 55.12,56.64 v1(57.4,54.36) ; v1(23.62,54.61) CN1.6
MUX3: length 99.3
  Top Layer w0.254: v1(60.71,53.09) 27.43,53.09 v1(27.18,53.34) ; U19.14 45.85,85.73 45.21,85.09 45.21,82.55 48.77,78.99 v1(51.31,78.99)
  Bottom Layer w0.254: v1(27.18,53.34) 5.08,53.34 CN1.7 ; v1(51.31,78.99) 56.64,73.66 56.64,57.15 v1(60.71,53.09)
MUX4: length 104.1
  Top Layer w0.254: v1(77.47,52.07) v1(29.97,52.07) ; U14.14 96.14,66.67 96.77,66.04 96.77,55.37 v1(96.27,54.86)
  Bottom Layer w0.254: v1(96.27,54.86) 93.47,52.07 v1(77.47,52.07) ; v1(29.97,52.07) CN1.8
MUX5: length 39.3
  Top Layer w0.254: U29.14 1.98,12.37 0.76,13.59 0.76,46.48 CN1.9
MUX6: length 66.6
  Top Layer w0.254: 49.73,38.73 54.23,38.73 v1(54.36,38.86) ; v1(32.26,50.55) 33.53,49.28 v1(56.13,49.28)
  Bottom Layer w0.254: v1(56.13,49.28) 54.36,47.5 v1(54.36,38.86) ; v1(32.26,50.55) 7.37,50.55 CN1.10
MUX7: length 91.8
  Top Layer w0.254: v1(45.72,44.7) 45.72,45.72 44.2,47.24 v1(33.27,47.24) ; 46.16,10.16 v1(43.43,10.16)
  Bottom Layer w0.254: v1(43.43,10.16) 42.67,10.92 42.67,25.15 45.72,25.15 51.56,30.99 51.56,41.91 48.77,44.7 v1(45.72,44.7) ; v1(33.27,47.24) 32.26,48.26 5.08,48.26 CN1.11
MUX8: length 101.1
  Top Layer w0.254: v1(95.5,36.32) 93.67,36.32 93.54,36.2 ; v1(24.64,46.99) 28.7,46.99 30.23,48.51 v1(73.91,48.51)
  Bottom Layer w0.254: v1(95.5,36.32) 96.27,37.08 96.27,41.66 89.41,48.51 v1(73.91,48.51) ; v1(24.64,46.99) CN1.12
$1I756/$1N942: length 6.8
  Top Layer w0.254: U11.7 32,62.87 28.83,66.04 CN2.1
$1I756/$1N946: length 6.8
  Top Layer w0.254: CN2.3 29.87,68.58 U11.5
$1I756/$1N951: length 6.3
  Top Layer w0.254: CN2.5 29.46,73.03 U3.7
$1I756/$1N956: length 6.3
  Top Layer w0.254: U3.5 30.1,75.56 28.19,73.66 CN2.7
$1I756/$1N961: length 9.4
  Top Layer w0.254: 33.04,81.92 31.89,81.92 30.73,80.76 30.73,78.11 28.83,76.2 CN2.9
$1I756/$1N970: length 9
  Top Layer w0.254: U4.5 31.89,84.45 30.1,82.66 30.1,80.64 28.19,78.74 CN2.11
$1I756/$1N975: length 12.4
  Top Layer w0.254: U5.7 32,90.81 29.46,88.27 29.46,83.19 CN2.13
$1I756/$1N980: length 12.8
  Top Layer w0.254: CN2.15 27.56,89.53 31.37,93.34 U5.5
$1I756/$1N1841: length 12.2
  Top Layer w0.254: CN2.16 25.02,89.53 22.48,92.08 U6.7
$1I756/$1N1844: length 11.1
  Top Layer w0.254: CN2.14 22.48,83.82 22.48,87.63 20.57,89.53 U6.5
$1I756/$1N1848: length 7.3
  Top Layer w0.254: CN2.12 20.57,83.19 U8.7
$1I756/$1N1852: length 7.3
  Top Layer w0.254: U8.5 20.57,80.64 CN2.10
$1I756/$1N1856: length 5.7
  Top Layer w0.254: U9.7 24.38,74.3 CN2.8
$1I756/$1N1860: length 5.7
  Top Layer w0.254: CN2.6 24.38,71.75 U9.5
$1I756/$1N1864: length 7.1
  Top Layer w0.254: U10.7 21.21,64.77 CN2.4
$1I756/$1N1868: length 7.1
  Top Layer w0.254: U10.5 20.57,62.23 24.38,66.04 CN2.2
$1I756/$1N3344: length 32.1
  Top Layer w0.254: U5.4 40.26,93.34 43.43,90.17 43.43,73.03 44.7,71.75 45.97,71.75 48.51,69.22 U12.15
$1I756/$1N3349: length 25
  Top Layer w0.254: 45.14,70.48 43.43,70.48 42.8,71.12 42.8,88.27 40.26,90.81 U5.2
$1I756/$1N3353: length 19.9
  Top Layer w0.254: U4.4 40.26,84.45 42.16,82.55 42.16,70.48 43.43,69.22 U12.2
$1I756/$1N3358: length 18.7
  Top Layer w0.254: U12.3 43.43,67.95 41.53,69.85 41.53,80.64 40.26,81.92 38.59,81.92
$1I756/$1N3363: length 13.6
  Top Layer w0.254: U12.4 43.43,66.67 40.89,69.22 40.89,74.93 40.26,75.56 U3.4
$1I756/$1N3368: length 11.9
  Top Layer w0.254: U12.5 43.43,65.41 40.26,68.58 40.26,72.39 39.62,73.03 U3.2
$1I756/$1N3373: length 7.1
  Top Layer w0.254: U12.6 40.89,64.14 39.62,65.41 U11.4
$1I756/$1N3378: length 6.6
  Top Layer w0.254: U11.2 U12.7
$1I756/$1N3403: length 31.2
  Top Layer w0.254: U10.4 11.05,62.23 9.14,64.14 9.14,78.74 4.7,83.19 4.7,84.45 3.3,85.85 2.09,85.85 U7.15
$1I756/$1N3408: length 23.8
  Top Layer w0.254: U7.1 9.78,82.11 9.78,66.67 11.68,64.77 U10.2
$1I756/$1N3412: length 18.7
  Top Layer w0.254: U7.2 9.14,85.73 10.41,84.45 10.41,73.66 12.32,71.75 U9.4
$1I756/$1N3424: length 17.4
  Top Layer w0.254: U7.3 9.78,87 11.05,85.73 11.05,76.2 12.95,74.3 U9.2
$1I756/$1N3429: length 12.3
  Top Layer w0.254: U7.4 9.78,88.27 11.68,86.36 11.68,81.92 12.95,80.64 U8.4
$1I756/$1N3434: length 11.4
  Top Layer w0.254: U8.2 12.95,83.19 12.32,83.82 12.32,87.63 10.41,89.53 U7.5
$1I756/$1N3439: length 7.1
  Top Layer w0.254: U7.6 12.32,90.81 13.59,89.53 U6.4
$1I756/$1N3444: length 6.6
  Top Layer w0.254: U7.7 U6.2
$1I774/$1N942: length 6.8
  Top Layer w0.254: CN3.1 73.66,64.77 76.84,61.59 U13.7
$1I774/$1N946: length 6.8
  Top Layer w0.254: CN3.3 74.7,67.31 U13.5
$1I774/$1N951: length 6.3
  Top Layer w0.254: CN3.5 74.29,71.75 U15.7
$1I774/$1N956: length 6.3
  Top Layer w0.254: U15.5 74.93,74.3 73.03,72.39 CN3.7
$1I774/$1N961: length 9.4
  Top Layer w0.254: CN3.9 73.66,74.93 75.56,76.84 75.56,79.49 76.72,80.64 U16.7
$1I774/$1N970: length 9
  Top Layer w0.254: CN3.11 73.03,77.47 74.93,79.38 74.93,81.39 76.72,83.19 U16.5
$1I774/$1N975: length 12.4
  Top Layer w0.254: U17.7 76.84,89.53 74.29,87 74.29,81.92 CN3.13
$1I774/$1N980: length 12.8
  Top Layer w0.254: U17.5 76.2,92.08 72.39,88.27 CN3.15
$1I774/$1N1841: length 12.2
  Top Layer w0.254: U18.7 67.31,90.81 69.85,88.27 CN3.16
$1I774/$1N1844: length 11.1
  Top Layer w0.254: U18.5 65.41,88.27 67.31,86.36 67.31,82.55 CN3.14
$1I774/$1N1848: length 7.3
  Top Layer w0.254: CN3.12 65.41,81.92 U20.7
$1I774/$1N1852: length 7.3
  Top Layer w0.254: U20.5 65.41,79.38 CN3.10
$1I774/$1N1856: length 5.7
  Top Layer w0.254: U21.7 69.22,73.03 CN3.8
$1I774/$1N1860: length 5.7
  Top Layer w0.254: U21.5 69.22,70.48 CN3.6
$1I774/$1N1864: length 7.1
  Top Layer w0.254: CN3.4 66.04,63.5 U22.7
$1I774/$1N1868: length 7.1
  Top Layer w0.254: U22.5 65.41,60.96 69.22,64.77 CN3.2
$1I774/$1N3344: length 32.1
  Top Layer w0.254: U17.4 85.09,92.08 88.26,88.9 88.26,71.75 89.53,70.48 90.81,70.48 93.34,67.95 U14.15
$1I774/$1N3349: length 25
  Top Layer w0.254: U17.2 85.09,89.53 87.63,87 87.63,69.85 88.26,69.22 U14.1
$1I774/$1N3353: length 19.9
  Top Layer w0.254: U16.4 85.09,83.19 87,81.28 87,69.22 88.26,67.95 U14.2
$1I774/$1N3358: length 18.7
  Top Layer w0.254: U16.2 85.09,80.64 86.36,79.38 86.36,68.58 88.26,66.67 U14.3
$1I774/$1N3363: length 13.6
  Top Layer w0.254: U15.4 85.09,74.3 85.72,73.66 85.72,67.95 88.26,65.41 U14.4
$1I774/$1N3368: length 11.9
  Top Layer w0.254: U15.2 84.46,71.75 85.09,71.12 85.09,67.31 88.26,64.14 89.97,64.14
$1I774/$1N3373: length 7.1
  Top Layer w0.254: U13.4 84.46,64.14 85.72,62.87 U14.6
$1I774/$1N3378: length 6.6
  Top Layer w0.254: U13.2 U14.7
$1I774/$1N3403: length 31.2
  Top Layer w0.254: U19.15 46.92,84.58 48.13,84.58 49.53,83.19 49.53,81.92 53.97,77.47 53.97,62.87 55.88,60.96 U22.4
$1I774/$1N3408: length 23.8
  Top Layer w0.254: U19.1 54.61,80.84 54.61,65.41 56.51,63.5 U22.2
$1I774/$1N3412: length 18.7
  Top Layer w0.254: U19.2 53.97,84.45 55.25,83.19 55.25,72.39 57.15,70.48 U21.4
$1I774/$1N3424: length 17.4
  Top Layer w0.254: U21.2 57.78,73.03 55.88,74.93 55.88,84.45 54.61,85.73 U19.3
$1I774/$1N3429: length 12.3
  Top Layer w0.254: U20.4 57.78,79.38 56.51,80.64 56.51,85.09 54.61,87 52.27,87
$1I774/$1N3434: length 11.4
  Top Layer w0.254: U19.5 55.25,88.27 57.15,86.36 57.15,82.55 57.78,81.92 U20.2
$1I774/$1N3439: length 7.1
  Top Layer w0.254: U18.4 58.42,88.27 57.15,89.53 U19.6
$1I774/$1N3444: length 6.6
  Top Layer w0.254: U19.7 U18.2
$1I810/$1N942: length 6.8
  Top Layer w0.254: CN4.1 29.21,13.63 32.38,10.46 U23.7
$1I810/$1N946: length 7.2
  Top Layer w0.254: U23.5 32.79,13.63 30.25,16.18 CN4.3
$1I810/$1N951: length 6.3
  Top Layer w0.254: U25.7 31.12,20.62 29.21,18.72 CN4.5
$1I810/$1N956: length 6.3
  Top Layer w0.254: U25.5 30.48,23.16 28.57,21.25 CN4.7
$1I810/$1N961: length 9.3
  Top Layer w0.254: U26.7 31.75,29.51 30.48,28.24 30.48,25.7 28.57,23.8 CN4.9
$1I810/$1N970: length 8.6
  Top Layer w0.254: U26.5 31.75,32.05 29.84,30.15 29.84,28.88 CN4.11
$1I810/$1N975: length 12.4
  Top Layer w0.254: CN4.13 29.21,30.78 29.21,31.42 31.12,33.32 31.12,37.77 31.75,38.4 U27.7
$1I810/$1N980: length 12.8
  Top Layer w0.254: CN4.15 30.48,34.59 30.48,40.31 31.12,40.94 U27.5
$1I810/$1N1841: length 11.1
  Top Layer w0.254: CN4.16 23.5,32.69 23.5,34.59 21.59,36.5 21.59,38.4 20.32,39.67 U28.7
$1I810/$1N1844: length 10.5
  Top Layer w0.254: CN4.14 21.59,32.05 21.59,33.95 19.28,36.26 U28.5
$1I810/$1N1848: length 7.3
  Top Layer w0.254: U30.7 20.32,30.78 CN4.12
$1I810/$1N1852: length 7.3
  Top Layer w0.254: U30.5 20.32,28.24 CN4.10
$1I810/$1N1856: length 5.7
  Top Layer w0.254: U31.7 24.13,21.89 CN4.8
$1I810/$1N1860: length 5.7
  Top Layer w0.254: U31.5 24.13,19.35 CN4.6
$1I810/$1N1864: length 7.1
  Top Layer w0.254: CN4.4 24.13,16.18 20.32,12.37 U32.7
$1I810/$1N1868: length 7.1
  Top Layer w0.254: U32.5 20.95,9.82 CN4.2
$1I810/$1N2749: length 13.3
  Top Layer w0.254: U27.4 39.6,42.21 46.35,42.21 47.24,41.32 47.24,40.69 48.26,39.67 U24.15
$1I810/$1N2754: length 7
  Top Layer w0.254: U27.2 38.74,38.4 41.28,40.94 U24.1
$1I810/$1N2758: length 11.4
  Top Layer w0.254: U24.2 41.91,39.67 39.75,37.51 39.75,33.47 U26.4
$1I810/$1N2763: length 13.3
  Top Layer w0.254: U26.2 39.37,29.51 40.39,30.53 40.39,36.88 41.91,38.4 U24.3
$1I810/$1N2768: length 17.8
  Top Layer w0.254: U24.4 41.91,37.13 40.89,36.11 40.89,25.95 38.33,23.39 U25.4
$1I810/$1N2773: length 19.3
  Top Layer w0.254: U24.5 43.14,35.86 41.4,34.12 41.4,22.02 40,20.62 U25.2
$1I810/$1N2778: length 24.7
  Top Layer w0.254: U23.4 38.33,13.23 41.91,16.81 41.91,33.36 43.14,34.59 U24.6
$1I810/$1N2783: length 26.9
  Top Layer w0.254: U24.7 43.14,33.32 42.54,32.72 42.54,13 40,10.46 U23.2
$1I810/$1N2803: length 14.3
  Top Layer w0.254: U32.4 11.83,7.92 6.35,7.92 5.08,9.19 5.08,10.46 4.32,11.22 2.47,11.22 U29.15
$1I810/$1N2813: length 7
  Top Layer w0.254: U32.2 12.7,12.37 10.16,9.82 7.82,9.82
$1I810/$1N2823: length 11.4
  Top Layer w0.254: U31.4 13.74,18.48 12.7,17.44 12.7,14.87 8.93,11.09 U29.2
$1I810/$1N2835: length 12.9
  Top Layer w0.254: U29.3 8.93,12.37 12.06,15.5 12.06,20.62 13.33,21.89 U31.2
$1I810/$1N2845: length 17.7
  Top Layer w0.254: U29.4 8.93,13.63 11.43,16.14 11.43,25.93 U30.4
$1I810/$1N2857: length 19.6
  Top Layer w0.254: U29.5 8.93,14.91 10.8,16.77 10.8,28.88 12.7,30.78 U30.2
$1I810/$1N2869: length 24.1
  Top Layer w0.254: U28.4 12.06,35.46 12.06,33.32 10.16,31.42 10.16,17.41 8.93,16.18 U29.6
$1I810/$1N2881: length 25.9
  Top Layer w0.254: 7.82,17.44 8.93,17.44 9.53,18.04 9.53,32.05 11.43,33.95 11.43,38.4 12.7,39.67 U28.2
$1I828/$1N942: length 6.8
  Top Layer w0.254: CN5.1 73.03,11.09 76.2,7.92 U33.7
$1I828/$1N946: length 7.2
  Top Layer w0.254: U33.5 76.6,11.09 74.06,13.63 CN5.3
$1I828/$1N951: length 6.3
  Top Layer w0.254: CN5.5 73.03,16.18 74.93,18.08 U35.7
$1I828/$1N956: length 6.3
  Top Layer w0.254: CN5.7 72.39,18.72 74.29,20.62 U35.5
$1I828/$1N961: length 9.3
  Top Layer w0.254: U36.7 75.56,26.97 74.29,25.7 74.29,23.16 72.39,21.25 CN5.9
$1I828/$1N970: length 8.6
  Top Layer w0.254: U36.5 75.56,29.51 73.66,27.6 73.66,26.34 CN5.11
$1I828/$1N975: length 12.4
  Top Layer w0.254: U37.7 75.56,35.86 74.93,35.23 74.93,30.78 73.03,28.88 73.03,28.24 CN5.13
$1I828/$1N980: length 12.8
  Top Layer w0.254: CN5.15 74.29,32.05 74.29,37.77 74.93,38.4 U37.5
$1I828/$1N1841: length 11.1
  Top Layer w0.254: CN5.16 67.31,30.15 67.31,32.05 65.41,33.95 65.41,35.86 64.13,37.13 U38.7
$1I828/$1N1844: length 10.5
  Top Layer w0.254: U38.5 63.1,33.72 65.41,31.42 65.41,29.51 CN5.14
$1I828/$1N1848: length 7.3
  Top Layer w0.254: CN5.12 64.13,28.24 U40.7
$1I828/$1N1852: length 7.3
  Top Layer w0.254: CN5.10 64.13,25.7 U40.5
$1I828/$1N1856: length 5.7
  Top Layer w0.254: U41.7 67.94,19.35 CN5.8
$1I828/$1N1860: length 5.7
  Top Layer w0.254: CN5.6 67.94,16.81 U41.5
$1I828/$1N1864: length 7.1
  Top Layer w0.254: U42.7 64.13,9.82 67.94,13.63 CN5.4
$1I828/$1N1868: length 7.1
  Top Layer w0.254: U42.5 64.77,7.28 CN5.2
$1I828/$1N2749: length 13.3
  Top Layer w0.254: U34.15 92.07,37.13 91.06,38.15 91.06,38.78 90.17,39.67 83.42,39.67 U37.4
$1I828/$1N2754: length 7
  Top Layer w0.254: U37.2 82.55,35.86 85.09,38.4 U34.1
$1I828/$1N2758: length 11.4
  Top Layer w0.254: U34.2 85.72,37.13 83.57,34.97 83.57,30.93 U36.4
$1I828/$1N2763: length 13.3
  Top Layer w0.254: U36.2 83.19,26.97 84.2,27.99 84.2,34.34 85.72,35.86 U34.3
$1I828/$1N2768: length 17.8
  Top Layer w0.254: U35.4 82.15,20.85 84.71,23.41 84.71,33.57 85.72,34.59 U34.4
$1I828/$1N2773: length 19.3
  Top Layer w0.254: U35.2 83.82,18.08 85.22,19.48 85.22,31.58 86.96,33.32 U34.5
$1I828/$1N2778: length 24.7
  Top Layer w0.254: U33.4 82.15,10.69 85.72,14.27 85.72,30.82 86.96,32.05 U34.6
$1I828/$1N2783: length 26.9
  Top Layer w0.254: U34.7 86.96,30.78 86.36,30.18 86.36,10.46 83.82,7.92 U33.2
$1I828/$1N2803: length 14.3
  Top Layer w0.254: 46.16,8.56 46.29,8.68 48.13,8.68 48.9,7.92 48.9,6.65 50.16,5.38 55.65,5.38 U42.4
$1I828/$1N2813: length 7
  Top Layer w0.254: U42.2 56.51,9.82 53.97,7.28 U39.1
$1I828/$1N2823: length 11.4
  Top Layer w0.254: 51.63,8.56 52.74,8.56 56.51,12.33 56.51,14.91 57.55,15.94 U41.4
$1I828/$1N2835: length 12.9
  Top Layer w0.254: U41.2 57.15,19.35 55.88,18.08 55.88,12.96 52.74,9.82 U39.3
$1I828/$1N2845: length 17.7
  Top Layer w0.254: U39.4 52.74,11.09 55.25,13.6 55.25,23.39 U40.4
$1I828/$1N2857: length 19.6
  Top Layer w0.254: U39.5 52.74,12.37 54.61,14.23 54.61,26.34 56.51,28.24 U40.2
$1I828/$1N2869: length 24.1
  Top Layer w0.254: U38.4 55.88,32.92 55.88,30.78 53.97,28.88 53.97,14.87 52.74,13.63 U39.6
$1I828/$1N2881: length 25.9
  Top Layer w0.254: U38.2 56.51,37.13 55.25,35.86 55.25,31.42 53.34,29.51 53.34,15.5 52.74,14.91 U39.7

## Copper pours and planes (outline as drawn; the poured copper is in the pictures)
GND on Top Layer: 0,99.06 97.79,99.06 97.79,0 0,0
VCC on Bottom Layer: 0.51,98.55 97.03,98.55 97.03,0.76 0.51,0.76

## Text on the board
Top Silkscreen Layer: latch | gnd | 18v | 5v | 1 | 3 | 5 | 7 | 2 | 4 | 6 | 8 | clock | ch8 | ch40 | ch1 | ch33 | ch41 | ch48 | ch9 | ch16 | ch56 | ch24 | ch49 | ch17 | ch32 | ch64 | ch57 | ch25 | Input | OUT3 | OUT1 | AmpBoard Mux8SMD v1 / AM UpnaLab 2023 | OUT4 | OUT2
